# Altium schematic sheet JD_PBL4_PROJEKT.SchDoc
size A4; SheetNumber: 1; SheetTotal: 1
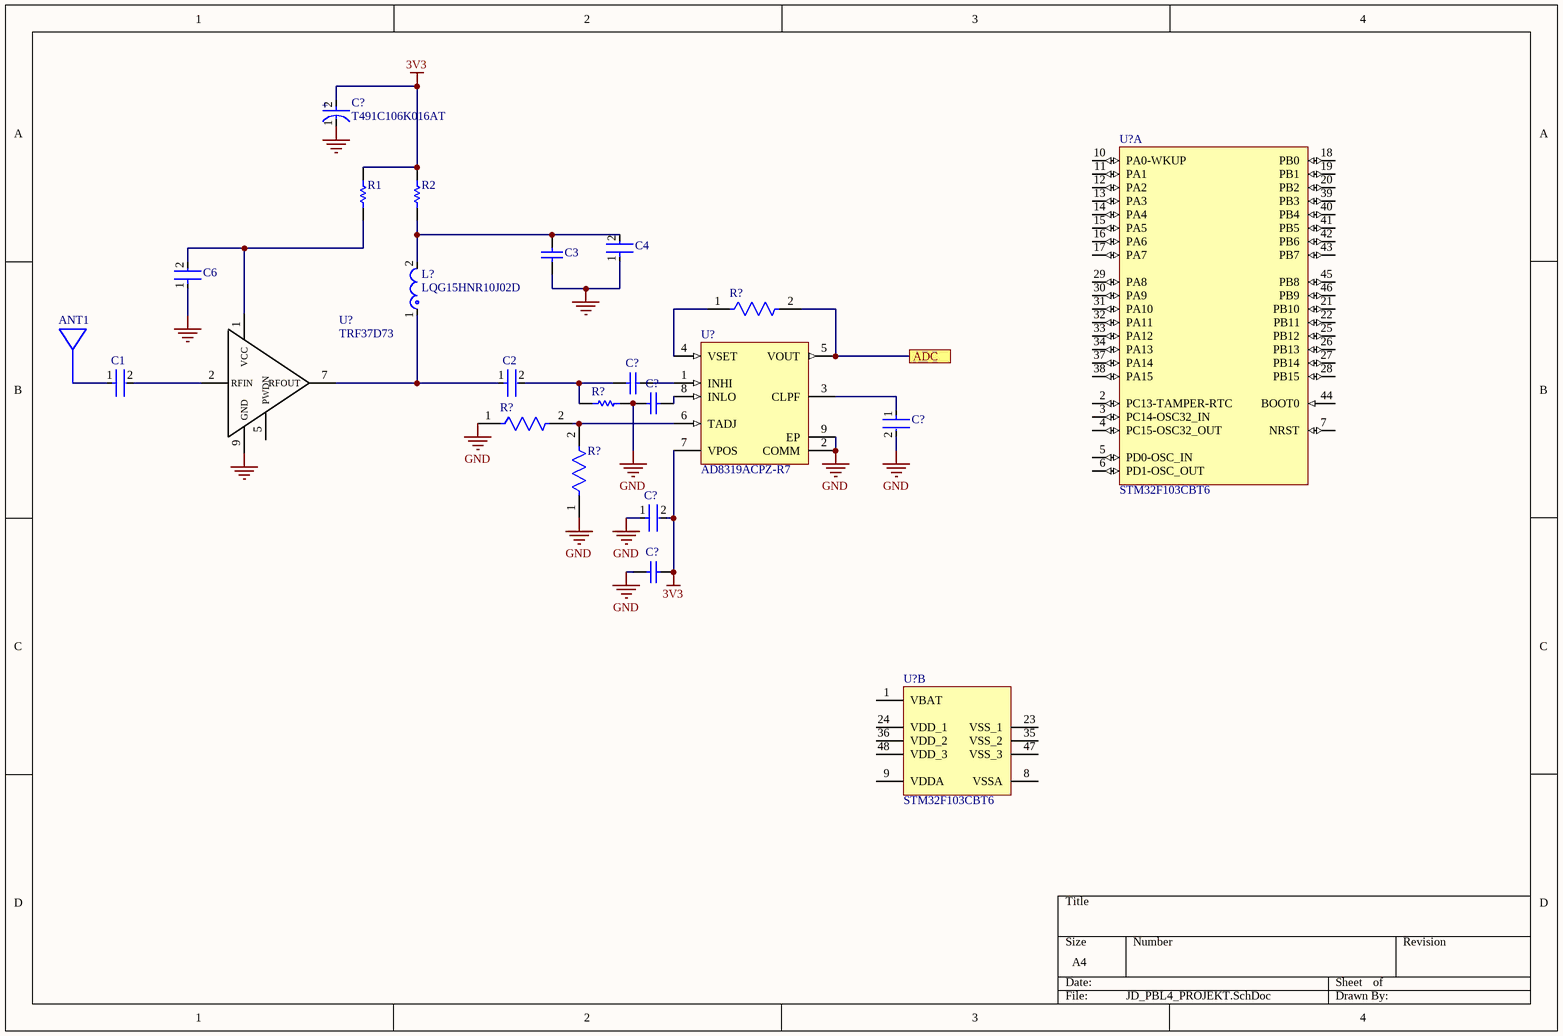
[diagram p0: JD_PBL4_PROJEKT.SchDoc]

## Parts
(Parts that share a designator on the sheet are numbered #1, #2 ... from top to bottom, then left to right.)
ANT1  RN-SMA-S  [FP-RN-SMA-S-MFG]  (value not drawn)
C1  GRM1555C1H102JA01D  [FP-GRM155-0_05-IPC_B]  (value not drawn)
C2  GRM1555C1H102JA01D  [FP-GRM155-0_05-IPC_B]  (value not drawn)
C3  GRM1555C1H100JZ01D  [CAPC1005X55X25ML05T10]  (value not drawn)
C4  C0603C103K1RACTU  [FP-C0603C-CF-MFG]  (value not drawn)
C6  GRM1555C1H102JA01D  [FP-GRM155-0_05-IPC_B]  (value not drawn)
C?#1  T491C106K016AT  [FP-T491C106K016AT-MFG]
C?#2  GRM1555C1H470JA01D  [CAPC1005X55X25LL05T10]  (value not drawn)
C?#3  GRM1555C1H470JA01D  [CAPC1005X55X25LL05T10]  (value not drawn)
C?#4  GRM1555C1H8R2DA01D  [FP-GRM155-0_05-MFG]  (value not drawn)
C?#5  C0603C104K5RACTU  [FP-C0603C-CF-MFG]  (value not drawn)
C?#6  GRM1555C1H101JA01D  [CAPC1005X55X25ML05T10]  (value not drawn)
L?  LQG15HNR10J02D  [FP-LQG15HH_02-IPC_A]
R1  CRCW06030000Z0EA  [RESC1609X50X30NL8T20]  (value not drawn)
R2  CRCW06030000Z0EA  [RESC1609X50X30NL8T20]  (value not drawn)
R?#1  CRCW04020000Z0ED  [FP-CRCW0402-e3-IPC_C]  (value not drawn)
R?#2  ERJ-2RKF52R3X  [RESC1005X40X25ML05T05]  (value not drawn)
R?#3  CRCW0402200RFKED  [FP-CRCW0402-e3-IPC_C]  (value not drawn)
R?#4  PNM0402E5000BST1  [FP-PNM0402-MFG]  (value not drawn)
U?#1  STM32F103CBT6  [STM-LQFP48_L]  (part A of 2)
U?#2  AD8319ACPZ-R7  [ADI-CP-8-1_L]
U?#3  TRF37D73  [JD_WSON-8]
U?#4  STM32F103CBT6  [STM-LQFP48_L]  (part B of 2)

## Ports
ADC

## Nets
3V3: C?#1.2(A) C?#5.2 C?#6.2 R1.2 R2.2 U?#2.7(VPOS)
GND: C3.1 C4.1 C6.1 C?#1.1(C) C?#3.1 C?#4.2 C?#5.1 C?#6.1 R?#2.2 R?#3.1 R?#4.1 U?#2.2(COMM) U?#2.9(EP) U?#3.9(GND)
ADC: R?#1.2 U?#2.5(VOUT) ; port ADC
NetC1_2: C1.2 U?#3.2(RFIN)
NetC2_1: C2.1 L?.1 U?#3.7(RFOUT)
NetC2_2: C2.2 C?#2.1 R?#2.1
NetC3_2: C3.2 C4.2 L?.2 R2.1
NetC6_2: C6.2 R1.1 U?#3.1(VCC)
NetC?#2_2: C?#2.2 U?#2.1(INHI)
NetC?#3_2: C?#3.2 U?#2.8(INLO)
NetC?#4_1: C?#4.1 U?#2.3(CLPF)
NetR?#1_1: R?#1.1 U?#2.4(VSET)
NetR?#3_2: R?#3.2 R?#4.2 U?#2.6(TADJ)

Not connected (* = marked no-connect by the designer): C1 1; U?#1 2(PC13-TAMPER-RTC) 3(PC14-OSC32_IN) 4(PC15-OSC32_OUT) 5(PD0-OSC_IN) 6(PD1-OSC_OUT) 7(NRST) 10(PA0-WKUP) 11(PA1) 12(PA2) 13(PA3) 14(PA4) 15(PA5) 16(PA6) 17(PA7) 18(PB0) 19(PB1) 20(PB2) 21(PB10) 22(PB11) 25(PB12) 26(PB13) 27(PB14) 28(PB15) 29(PA8) 30(PA9) 31(PA10) 32(PA11) 33(PA12) 34(PA13) 37(PA14) 38(PA15) 39(PB3) 40(PB4) 41(PB5) 42(PB6) 43(PB7) 44(BOOT0) 45(PB8) 46(PB9); U?#3 5(PWDN); U?#4 1(VBAT) 8(VSSA) 9(VDDA) 23(VSS_1) 24(VDD_1) 35(VSS_2) 36(VDD_2) 47(VSS_3) 48(VDD_3)

## Notes on the sheet
- (in symbol CMP-2000-07197-3) +

## Library data of the parts
ANT1 = CMP-06329-000001-1: RF ANT 2.4GHZ WHIP STR SMA ML 1"; Input Impedance: 50R; Number of Bands: 1; Gain: 0.56dB; VSWR: 2.5; Height: 1.118inch; Connector Type: SMA; Series: -; Package Quantity: 1; Termination: SMA; REACH SVHC: No SVHC; Mount: Connector; Frequency: 2.4GHz; Case/Package: SMA; Lead Free: Lead Free; Operating Frequency: 2.4 GHz; Packaging: Bulk; Radiation Hardening: No
C1 C2 C6 = CMP-2008-04254-2: Chip Multilayer Ceramic Capacitors for General Purpose, 0402, 1000pF, C0G, 30ppm/°C, 5%, 50V; Insulation Resistance: 10GR; Capacitance: 1nF; Packaging: Tape and Reel; Lead Free: Lead Free; Tolerance: 5%; Temperature Coefficient: 30ppm/°C; Thickness: 0.022inch; Termination: SMD/SMT; Max Operating Temperature: 125°C; Height: 0.5mm; Package Quantity: 1; Radiation Hardening: No; Material: Ceramic; Case Code (Metric): 1005; Number of Pins: 2; Voltage Rating: 50V; Mount: Surface Mount; Voltage: 50V; Case/Package: 0402; Min Operating Temperature: -55°C; Dielectric Material: Ceramic; Width: 0.5mm; Depth: 0.5mm; Case Code (Imperial): 0402; REACH SVHC: No SVHC; Dielectric: C0G; Voltage Rating (DC): 50V; Length: 1mm
C3 = CMP-2008-04246-1: Manufacturer: Murata; Part Number: GRM1555C1H100JZ01D
C4 = CMP-2006-03036-2: CAP CER 10000PF 100V X7R 0603; Manufacturer: KEMET; Temperature Coefficient: 30ppm/°C; Capacitance: 10,000 pF; Automotive Grade: Grade 1; Value: 10,000 pF; Tolerance: 0.1; Material: Ceramic; ComponentLink2URL: https://api.kemet.com/component-edge/download/datasheet/C0603C100J5GACAUTO.pdf; Height: 0.87mm; ComponentLink2Description: Datasheet; Category: Cap; Mouser Description: Multilayer Ceramic Capacitors MLCC - SMD/SMT 100volts 10000pF X7R 10%; Device Class L3: Ceramic Capacitors; Voltage Rating: 100 V; Temperature Range High: +125°C; Octopart: https://octopart.com/c0603c103k1ractu-kemet-134140; Package: C0603C-CF; Temperature Range Low: -55°C; Device Class L1: Passive Components; Temperature: -55°C to +125°C; RoHS: TRUE; Device Class L2: Capacitors; Lead Free: Yes; Temperature Characteristic: X7R; Manufacturer Part Number: C0603C103K1RACTU; Digikey Description: CAP CER 10000PF 100V X7R 0603; Automotive: Yes
C?#1 = CMP-2000-07197-3: CAP TANT 10UF 10% 16V 2312; Dielectric Material: Tantalum; Polarity: Polar; Dissipation Factor: 6%; Leakage Current: 1.6uA; Ripple Current: 247mA; Life (Hours): 2000Hour; ESR (Equivalent Series Resistance): 1.8R; Height: 2.5mm; Length: 6mm; Min Operating Temperature: -55°C; Case/Package: Molded; Voltage: 16V; Height - Seated (Max): 0.11inch; Package Quantity: 1; RoHS Compliant: Yes; Termination: SMD/SMT; REACH SVHC: No SVHC; Case Code (Imperial): 2312; Tolerance: 10%; Capacitance: 10uF; Voltage Rating (DC): 16V; Mount: Surface Mount; Radiation Hardening: No; Case Code (Metric): 6032; Packaging: Tape and Reel; Depth: 3.2mm; Width: 3.2mm; Max Operating Temperature: 125°C; Features: General Purpose; Voltage Rating: 16V; Lead Free: Lead Free
C?#2 C?#3 = CMP-2008-04368-1: Manufacturer: Murata; Part Number: GRM1555C1H470JA01D
C?#4 = CMP-2008-04448-2: CAP CER 8.2PF 50V C0G/NP0 0402; Material: Ceramic; Temperature Coefficient: 30ppm/°C; Dielectric: C0G; Mount: Surface Mount; Voltage Rating: 50V; RoHS Compliant: Yes; Depth: 0.5mm; Case Code (Imperial): 0402; Case/Package: 0402; Thickness: 0.022inch; Max Operating Temperature: 125°C; Construction: Flat; Length: 1mm; REACH SVHC: No SVHC; Series: GRM; Termination: SMD/SMT; Lead Free: Lead Free; Width: 0.02inch; Capacitance: 8.2pF; Voltage: 50V; Packaging: Tape and Reel; Radiation Hardening: No; Voltage Rating (DC): 50V; Height: 0.5mm; Package Quantity: 10000; Case Code (Metric): 1005; Min Operating Temperature: -55°C
C?#5 = CMP-2006-03061-2: CAP CER 0.1UF 50V X7R 0603; Manufacturer: KEMET; Tolerance: 0.1; Description: C0603 0.10 μF X7R 30ppm/°C 10.00% 50 V; Temperature Coefficient: 30ppm/°C; Material: Ceramic; Automotive Grade: Grade 1; Value: 0.10 μF; Temperature: -55°C to +125°C; RoHS: TRUE; Temperature Range High: +125°C; Lead Free: Yes; Octopart: https://octopart.com/c0603c104k5ractu-kemet-139244; Digikey Description: CAP CER 0.1UF 50V X7R 0603; Category: Cap; Package: C0603C-CF; ComponentLink2Description: Datasheet; Temperature Range Low: -55°C; Device Class L1: Passive Components; Voltage Rating: 50 V; Automotive: Yes; Device Class L3: Ceramic Capacitors; ComponentLink2URL: https://api.kemet.com/component-edge/download/datasheet/C0603C100J5GACAUTO.pdf; Capacitance: 0.10 μF; Device Class L2: Capacitors; Manufacturer Part Number: C0603C104K5RACTU; Temperature Characteristic: X7R; Height: 0.87mm
C?#6 = CMP-2008-03915-1: Manufacturer: Murata; Part Number: GRM1555C1H101JA01D
L? = CMP-06042-011120-1: Multilayer type RF Inductor 100nH ±5% 1.6Ω 200mA 0402; Q Factor: 8; DC Resistance (DCR): 1.6R; Current Rating: 150mA; Core Material: Air; Shielding: Unshielded; Self Resonant Frequency: 600MHz; Test Frequency: 100MHz; Depth: 0.55mm; Number of Pins: 2; Length: 0.039inch; Termination: SMD/SMT; Height: 0.5mm; Inductance: 100nH; Case/Package: 0402; Inductance Tolerance: 5%; Military Standard: Not; Lead Free: Lead Free; Radiation Hardening: No; Mount: Surface Mount; Case Code (Metric): 1005; Case Code (Imperial): 0402; Max DC Current: 150mA; Width: 0.02inch; Packaging: Tape and Reel; Max Operating Temperature: 125°C; DC Current: 150mA; Min Operating Temperature: -55°C; Tolerance: 5%; Height - Seated (Max): 0.022inch; REACH SVHC: No SVHC; Package Quantity: 1
R1 R2 = CMP-2000-03816-5: Chip Resistor, 0 Ohm, Jumper, 100 mW, -55 to 155 degC, 0603 (1608 Metric), RoHS, Tape and Reel; Manufacturer: Vishay Semiconductor; Voltage Rating: 75 V; Package Quantity: 5000; DatasheetVersion: 06/2012; Min Operating Temperature: -55 degC; ComponentLink1URL: http://www.vishay.com/; Mounting Technology: Surface Mount; Height: 0.45 mm; ComponentLink1Description: Manufacturer URL; REACH SVHC: Unknown; PackageReference: 0603; Packaging: Tape and Reel; Max Operating Temperature: 155 degC; Mount: Surface Mount; ComponentLink2Description: Datasheet; PackageDescription: 2-Pin Surface Mount Device, Body 1.575 x 0.85 mm; Length: 1.55 mm; ComponentLink2URL: http://www.vishay.com/docs/20035/dcrcwe3.pdf; Pins: 2; RoHSCompliant: true
R?#1 = CMP-2002-08122-2: RES Thick Film, 0Ω, 0.063W, 0402; Tolerance: 5%; Max Power Dissipation: 63mW; Voltage Rating: 50V; Temperature Coefficient: 100ppm/°C; Resistance: 0mR; Contact Plating: Tin; Height: 0.35mm; Radiation Hardening: No; Features: Automotive AEC-Q200; Composition: Thick Film; Width: 0.5mm; Weight: 2.3E-05oz; Termination: SMD/SMT; Packaging: Tape and Reel; Mount: Surface Mount; Case Code (Metric): 1005; Military Standard: Not; Min Operating Temperature: -55°C; Number of Terminations: 2; Package Quantity: 1; Case Code (Imperial): 0402; Depth: 0.5mm; Max Operating Temperature: 155°C; Case/Package: 0402; Power Rating: 63mW; Lead Free: Lead Free; Voltage Rating (DC): 50V; Length: 1mm
R?#2 = CMP-1011-00366-2: Manufacturer: Panasonic; Part Number: ERJ-2RKF52R3X
R?#3 = CMP-1011-00429-3: RES Thick Film, 200Ω, 1%, 0.063W, 100ppm/°C, 0402; Max Power Dissipation: 63mW; Voltage Rating: 50V; Resistance: 200R; Termination: SMD/SMT; Weight: 2.3E-05oz; Case/Package: 0402; Contact Plating: Tin; Number of Pins: 2; Width: 0.5mm; Height: 0.35mm; Case Code (Metric): 1005; Military Standard: Not; Features: Automotive AEC-Q200; Power Rating: 63mW; Temperature Coefficient: 100ppm/°C; Tolerance: 1%; Lead Free: Lead Free; Depth: 0.5mm; Max Operating Temperature: 155°C; Min Operating Temperature: -55°C; Package Quantity: 10; Voltage Rating (DC): 50V; Composition: Thick Film; Mount: Surface Mount; Radiation Hardening: No; Length: 1mm; Packaging: Tape and Reel; Number of Terminations: 2; Case Code (Imperial): 0402
R?#4 = CMP-02407-011888-1: RES SMD 500 OHM 0.1% 1/20W 0402; Temperature Coefficient: 25ppm/°C; Max Power Dissipation: 50mW; Resistance: 500R; Width: 0.022inch; Length: 0.042inch; Tolerance: 0.1%; Lead Free: Lead Free; Height: 0.033inch; Case Code (Metric): 1005; Features: Moisture Resistant; Case Code (Imperial): 0402; Max Operating Temperature: 155°C; Case/Package: 0402; Min Operating Temperature: -55°C; Package Quantity: 1000; RoHS Compliant: Yes; Packaging: Tape and Reel; Resistor Type: Thin Film; Number of Terminations: 2
U?#1 U?#4 = CMP-0237-00250-3: ARM Cortex-M3 32-bit MCU, 128 KB Flash, 20 KB Internal RAM, 37 I/Os, 48-pin LQFP, -40 to 85 degC, Tray; Supply Voltage(Vcc) min (V): 2; Operating Frequency(F) (Processor speed) (MHz): 72; A/D Converter: 2x12-bit (10 Channel); FLASH Size (Prog) (kB): 128; Internal RAM Size (kB): 20; I/Os (High Current): 37; ComponentLink2Description: Datasheet; PackageReference: LQFP48; PartNumber: STM32F103CBT6; ComponentLink1Description: Manufacturer URL; DatasheetVersion: Rev. 16; PackageVersion: Rev. 6, 06/2013; Packing: Tray; ComponentLink1URL: http://www.st.com/web/en/home.html; Mounting Technology: Surface Mount; ComponentLink3URL: http://www.st.com/st-web-ui/static/active/en/resource/technical/document/datasheet/DM00058181.pdf; PackageDescription: 48-Pin Low Profile Quad Flat Package, 7 x 7 mm Body, 0.5 mm Pitch; Core: ARM Cortex-M3; ComponentLink3Description: Package Specification; ComponentLink2URL: http://www.st.com/st-web-ui/static/active/en/resource/technical/document/datasheet/CD00161566.pdf
U?#2 = CMP-0284-00069-1: 1 MHz to 10 GHz, 45 dB Log Detector/Controller, 6ns Response Time, CP-8-1, Pb-Free, 3000 Reel; Temp Stability (dB): 500mdB; Voltage Supply (V): 3 to 5.5; Dynamic Range (dB): 45dB; Product Description: Available in Die; Supply Current: 22mA; RF Frequency (MHz): 1 to 10000; PackageReference: CP-8-1; ComponentLink3Description: Package Specification; ComponentLink3URL: http://www.analog.com/static/imported-files/packages/PKG_PDF/LFCSP(CP)/CP-8/CP_8_1.pdf; ComponentLink1Description: Manufacturer URL; Response Time (ns typ): 6ns; ComponentLink2URL: http://www.analog.com/static/imported-files/data_sheets/AD8319.pdf; PackageVersion: 031207-A; ComponentLink2Description: Datasheet; DatasheetVersion: Rev. B; PackageDescription: 8-Lead Lead Frame Chip Scale Package [LFCSP_VD]; ComponentLink1URL: www.analog.com
U?#3 = JD_TRF37D73_WSON-8